# Altium schematic sheet 13-connectors.SchDoc: Connectors
size Letter; DrawnBy: J. Brinton; Engineer: J. Brinton; Revision: 1; SheetNumber: 13; SheetTotal: 14
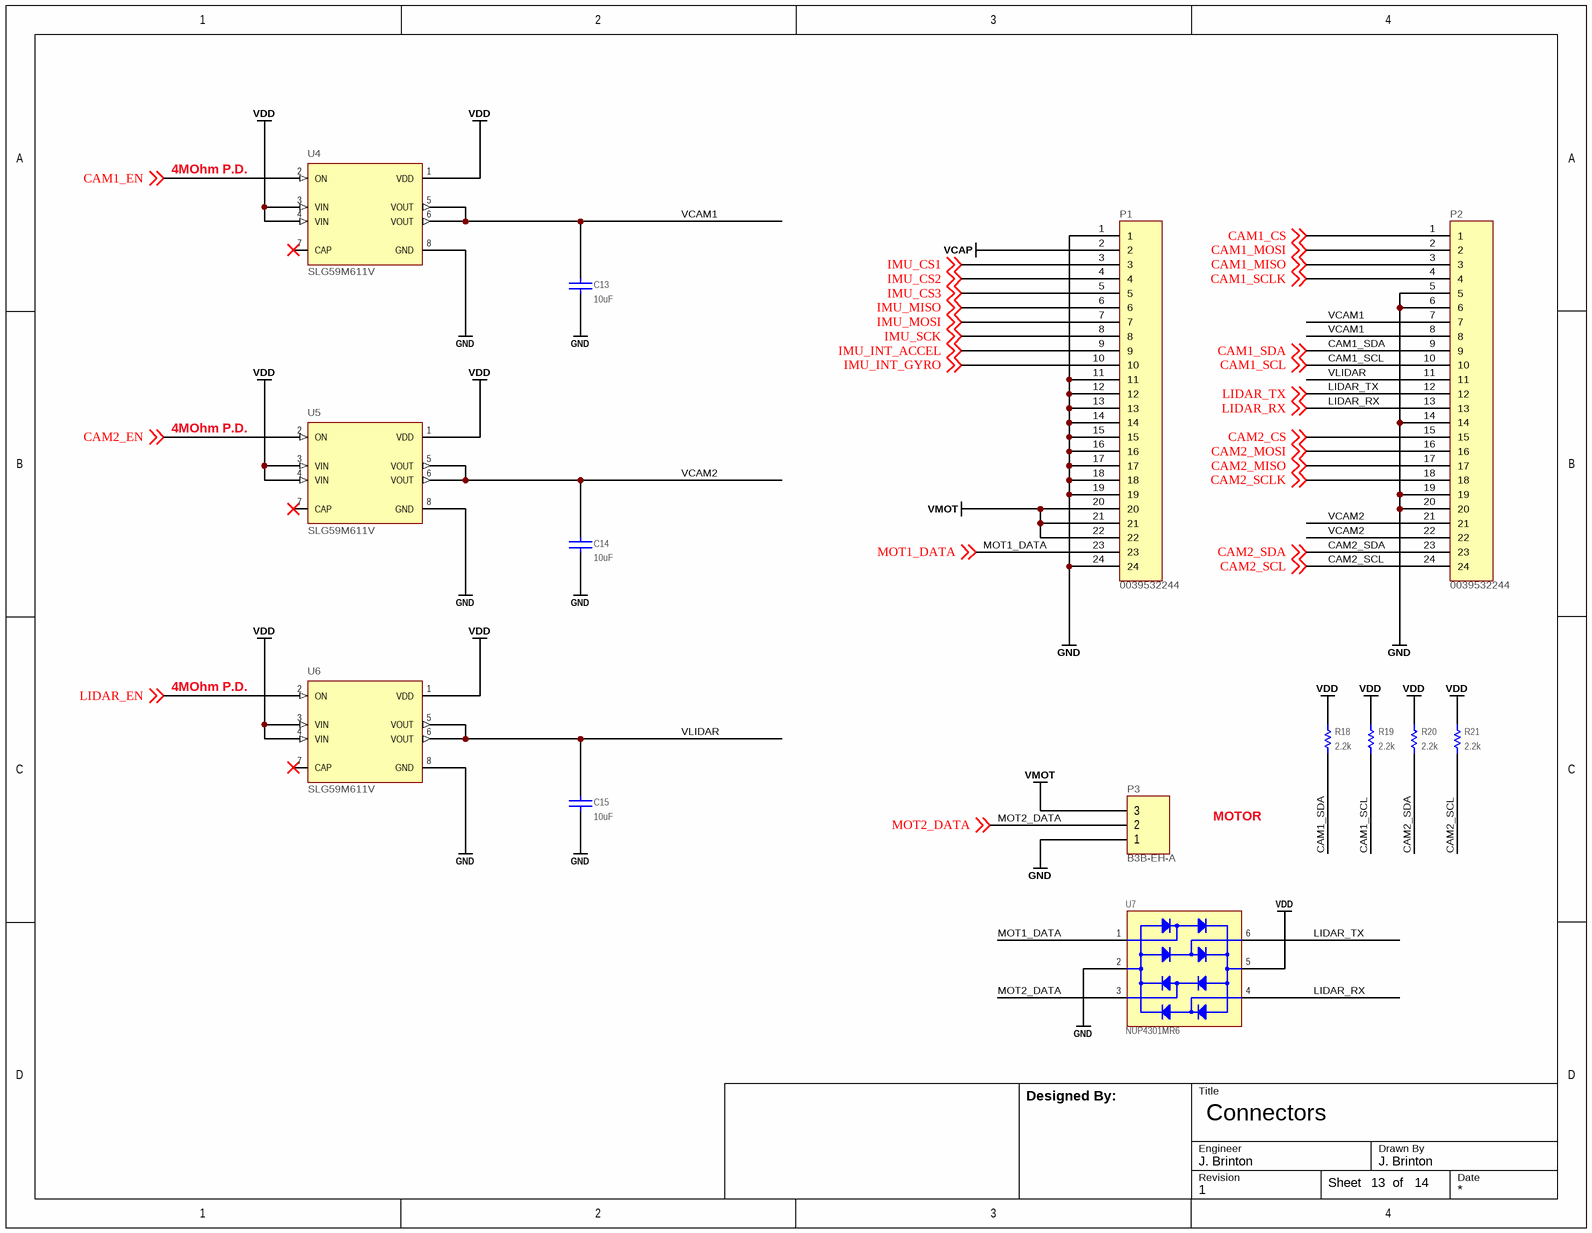
[diagram p0: 13-connectors.SchDoc]

## Parts
C13  value 10uF  [CAPC160X80X90L20N]  (hidden comment: ZRB18AR61E106ME01L)
C14  value 10uF  [CAPC160X80X90L20N]  (hidden comment: ZRB18AR61E106ME01L)
C15  value 10uF  [CAPC160X80X90L20N]  (hidden comment: ZRB18AR61E106ME01L)
P1  0039532244  [0039532244]
P2  0039532244  [0039532244]
P3  B3B-EH-A  [B3B-EH-A]
R18  value 2.2k  [RESC2012X70N]  (hidden comment: ERA-6AEB222V)
R19  value 2.2k  [RESC2012X70N]  (hidden comment: ERA-6AEB222V)
R20  value 2.2k  [RESC2012X70N]  (hidden comment: ERA-6AEB222V)
R21  value 2.2k  [RESC2012X70N]  (hidden comment: ERA-6AEB222V)
U4  SLG59M611V  [DFN200X150X80-8N]
U5  SLG59M611V  [DFN200X150X80-8N]
U6  SLG59M611V  [DFN200X150X80-8N]
U7  NUP4301MR6  [SOT23-6]

## Nets
GND: C13.1 C14.1 C15.1 P1.1 P1.11 P1.12 P1.13 P1.14 P1.15 P1.16 P1.17 P1.18 P1.19 P1.24 P2.5 P2.6 P2.14 P2.19 P2.20 P3.1 U4.8(GND) U5.8(GND) U6.8(GND) U7.2(VN)
VCAP: P1.2
VDD: R18.2 R19.2 R20.2 R21.2 U4.1(VDD) U4.3(VIN) U4.4(VIN) U5.1(VDD) U5.3(VIN) U5.4(VIN) U6.1(VDD) U6.3(VIN) U6.4(VIN) U7.5(VP)
VMOT: P1.20 P1.21 P1.22 P3.3
CAM1_CS: P2.1 ; off-sheet CAM1_CS
CAM1_EN: U4.2(ON) ; off-sheet CAM1_EN
CAM1_MISO: P2.3 ; off-sheet CAM1_MISO
CAM1_MOSI: P2.2 ; off-sheet CAM1_MOSI
CAM1_SCL: P2.10 R19.1 ; off-sheet CAM1_SCL
CAM1_SCLK: P2.4 ; off-sheet CAM1_SCLK
CAM1_SDA: P2.9 R18.1 ; off-sheet CAM1_SDA
CAM2_CS: P2.15 ; off-sheet CAM2_CS
CAM2_EN: U5.2(ON) ; off-sheet CAM2_EN
CAM2_MISO: P2.17 ; off-sheet CAM2_MISO
CAM2_MOSI: P2.16 ; off-sheet CAM2_MOSI
CAM2_SCL: P2.24 R21.1 ; off-sheet CAM2_SCL
CAM2_SCLK: P2.18 ; off-sheet CAM2_SCLK
CAM2_SDA: P2.23 R20.1 ; off-sheet CAM2_SDA
IMU_CS1: P1.3 ; off-sheet IMU_CS1
IMU_CS2: P1.4 ; off-sheet IMU_CS2
IMU_CS3: P1.5 ; off-sheet IMU_CS3
IMU_INT_ACCEL: P1.9 ; off-sheet IMU_INT_ACCEL
IMU_INT_GYRO: P1.10 ; off-sheet IMU_INT_GYRO
IMU_MISO: P1.6 ; off-sheet IMU_MISO
IMU_MOSI: P1.7 ; off-sheet IMU_MOSI
IMU_SCK: P1.8 ; off-sheet IMU_SCK
LIDAR_EN: U6.2(ON) ; off-sheet LIDAR_EN
LIDAR_RX: P2.13 U7.4(C) ; off-sheet LIDAR_RX
LIDAR_TX: P2.12 U7.6(D) ; off-sheet LIDAR_TX
MOT1_DATA: P1.23 U7.1(A) ; off-sheet MOT1_DATA
MOT2_DATA: P3.2 U7.3(B) ; off-sheet MOT2_DATA
VCAM1: C13.2 P2.7 P2.8 U4.5(VOUT) U4.6(VOUT)
VCAM2: C14.2 P2.21 P2.22 U5.5(VOUT) U5.6(VOUT)
VLIDAR: C15.2 P2.11 U6.5(VOUT) U6.6(VOUT)

Not connected (* = marked no-connect by the designer): U4 7(CAP)*; U5 7(CAP)*; U6 7(CAP)*

## Notes on the sheet
- 4MOhm P.D.
- MOTOR
- Designed By:
- Title
- Engineer
- Revision
- Drawn By
- Date
- Sheet
- of

## Library data of the parts
C13-C15 = CAP 0603: Ceramic Capacitor 10uF ±20% 25V X5R 0603; Manufacturer: Murata; Tr: -55:85; Manufacturer P/N: ZRB18AR61E106ME01L; Voltage: 25V; Package: 0603; Tolerance: ±20%
P1 P2 = 0039532244: FPC connector; Manufacturer: Molex; Manufacturer P/N: 0039532244
P3 = Header 3: 2.5mm pitch crimp connector; Manufacturer: JST; Manufacturer P/N: B3B-EH-A
R18-R21 = RES: Thin Film Resistor 2.2k ±0.1% 0.125W 100V 0805; Manufacturer: Panasonic; Tcr: ±25; Tr: -55:155; Voltage: 100; Power: 0.125; Tolerance: ±0.1%; Manufacturer P/N: ERA-6AEB222V; Package: 0805
U4-U6 = SLG59M611V: High-Side Load Switch; Manufacturer: Silego; Package: WFDFN-8 Silego; Manufacturer P/N: SLG59M611V
U7 = NUP4301MR6: 4-Lane TVS Diode Array; Manufacturer: On Semiconductor; Manufacturer P/N: NUP4301MR6